# EasyEDA schematic SCH_St-Peters-Crest_2025-05-22.json
TITLE: LDR Colorimeter Mother Board 3; REV: 1.0; Date: 2023-10-12; Sheet: 1/1; Drawn By: d.c.gilmour; Company: Your Company
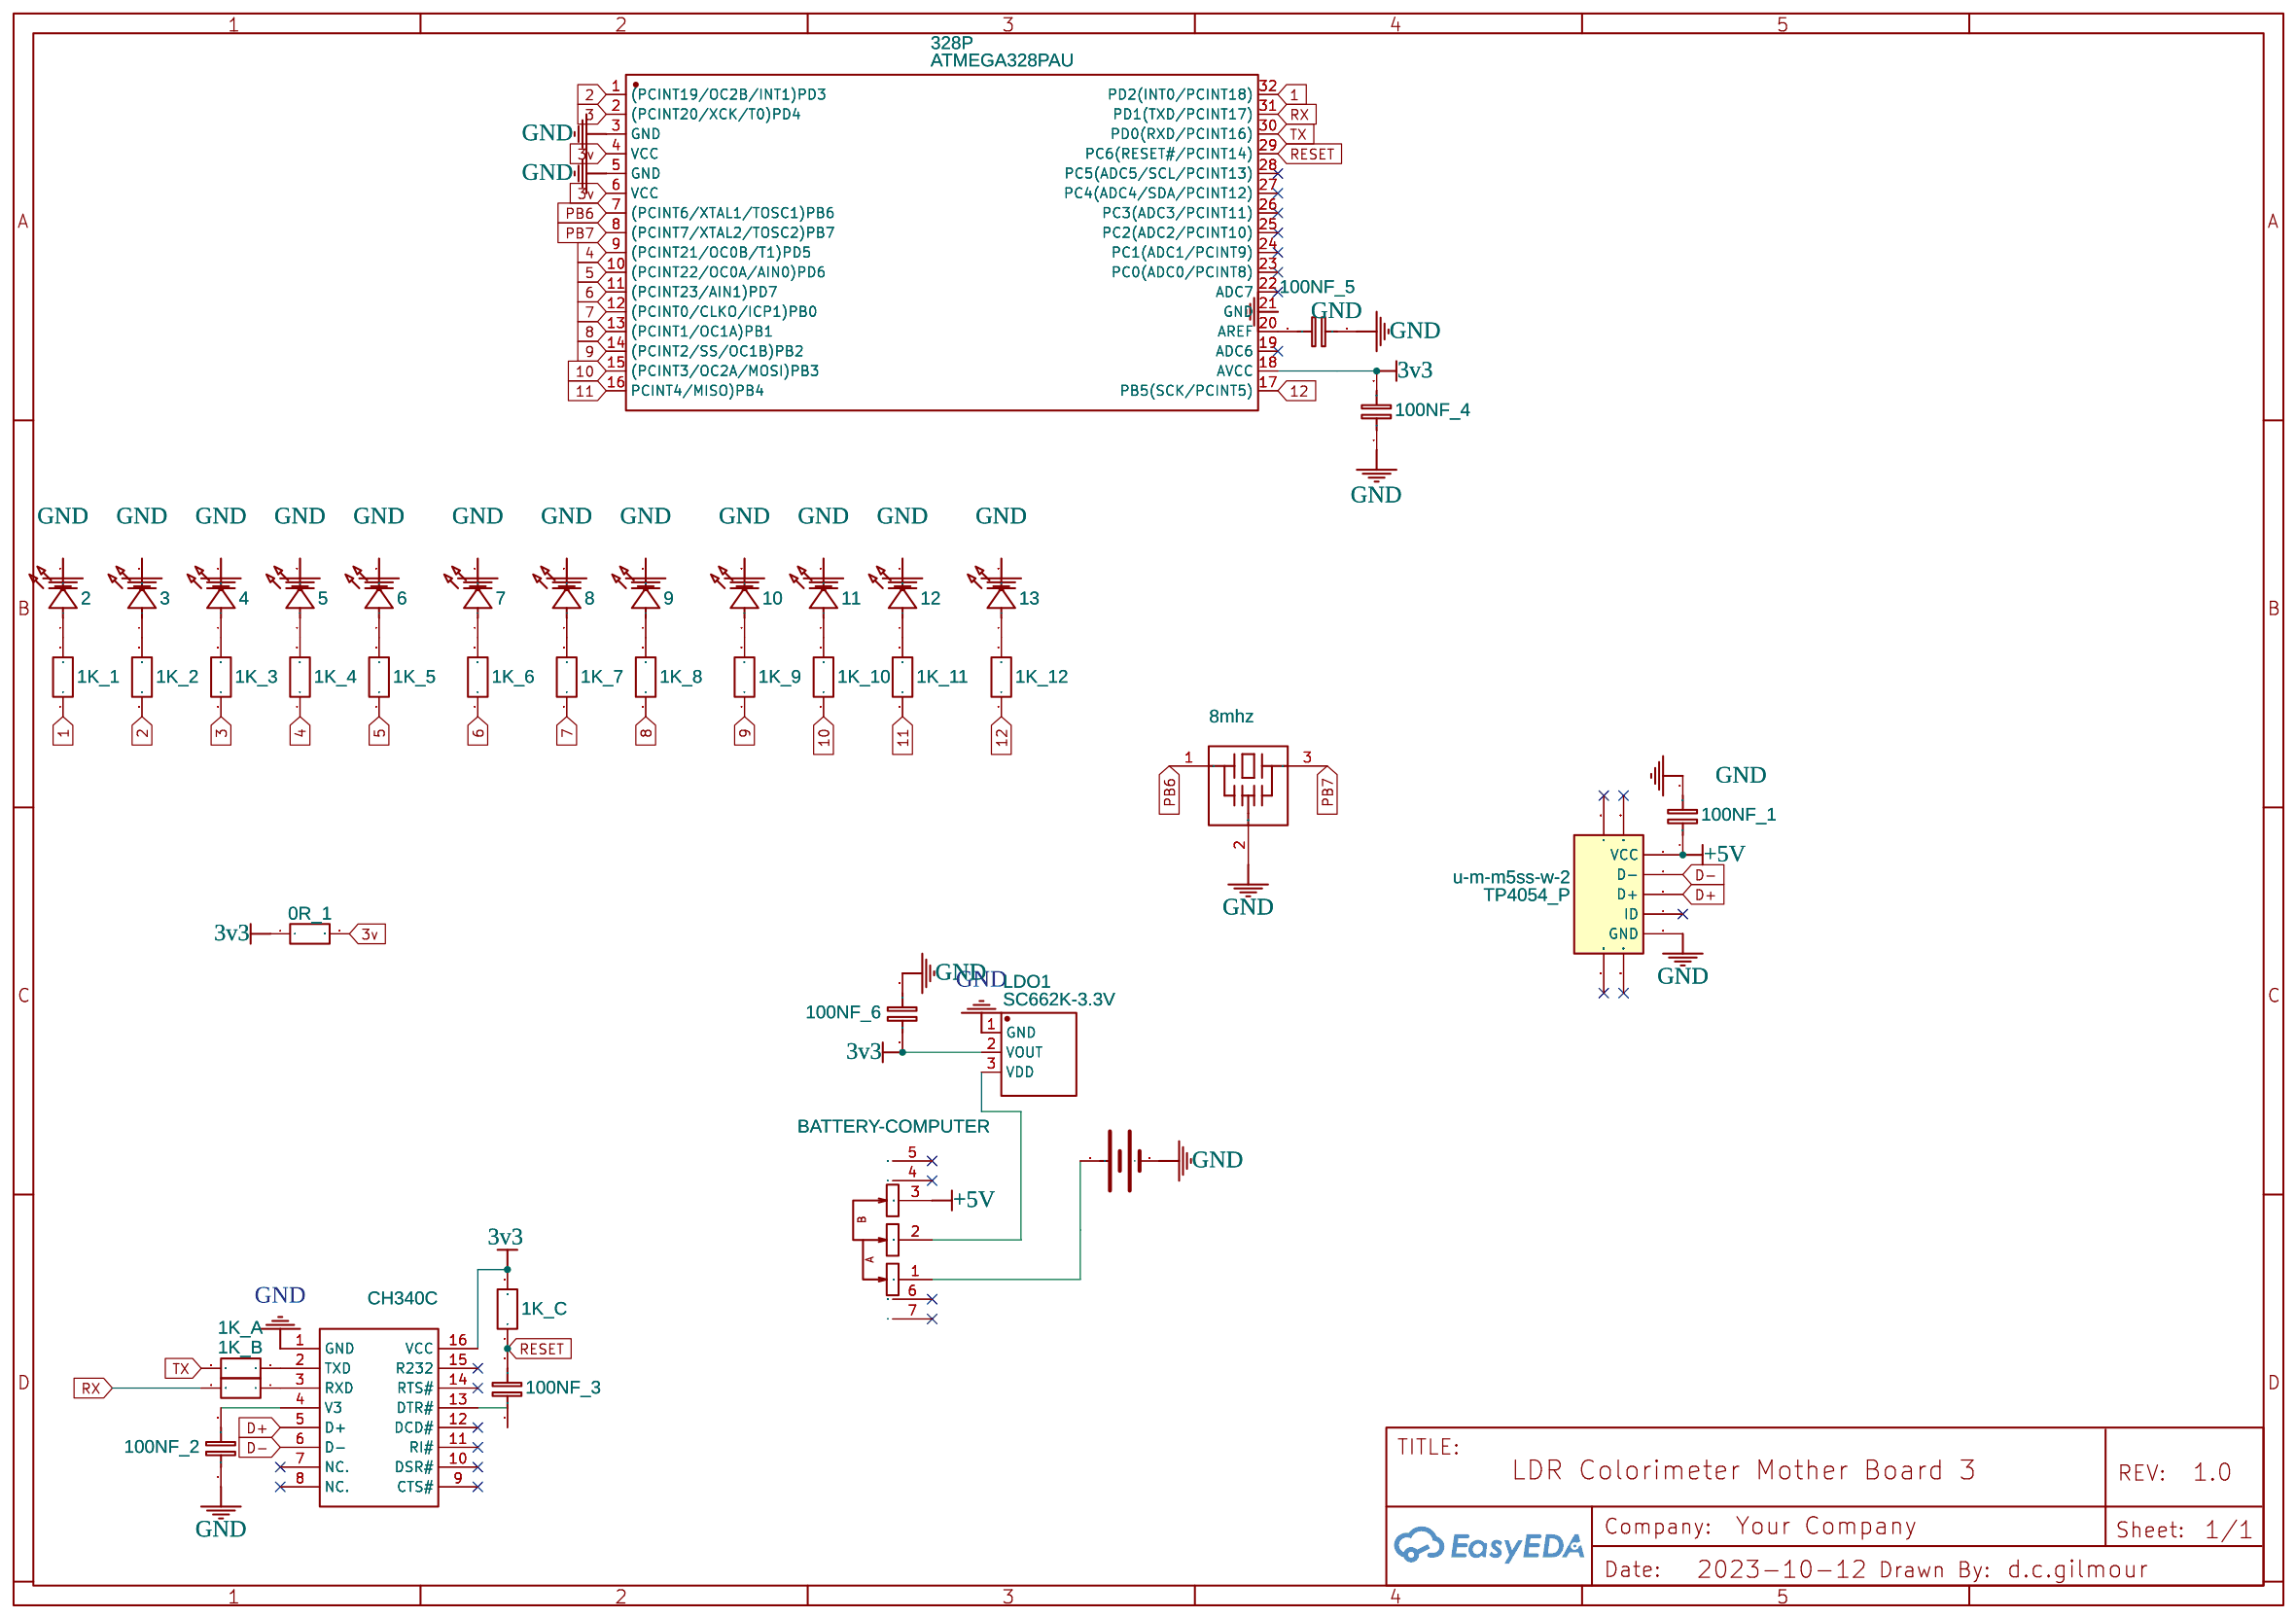
[diagram p0: schematic sheet]

## Parts
0R_1  1k  [R0603]
1K_1  1k  [R0603]
1K_2  1k  [R0603]
1K_3  1k  [R0603]
1K_4  1k  [R0603]
1K_5  1k  [R0603]
1K_6  1k  [R0603]
1K_7  1k  [R0603]
1K_8  1k  [R0603]
1K_9  1k  [R0603]
1K_10  1k  [R0603]
1K_11  1k  [R0603]
1K_12  1k  [R0603]
1K_A  1k  [R0603]
1K_B  1k  [R0603]
1K_C  1k  [R0603]
2  XL-3216SURC  [LED1206-R-RD_RED]
3  XL-3216SURC  [LED1206-R-RD_RED]
4  XL-3216SURC  [LED1206-R-RD_RED]
5  XL-3216SURC  [LED1206-R-RD_RED]
6  XL-3216SURC  [LED1206-R-RD_RED]
7  XL-3216SURC  [LED1206-R-RD_RED]
8  XL-3216SURC  [LED1206-R-RD_RED]
9  XL-3216SURC  [LED1206-R-RD_RED]
10  XL-3216SURC  [LED1206-R-RD_RED]
11  XL-3216SURC  [LED1206-R-RD_RED]
12  XL-3216SURC  [LED1206-R-RD_RED]
13  XL-3216SURC  [LED1206-R-RD_RED]
16MHZ  8mhz  [OSC-SMD_3P-L3.2-W1.3-P1.2-L]
100NF_1  0.1u  [C0603]
100NF_2  0.1u  [C0603]
100NF_3  0.1u  [C0603]
100NF_4  0.1u  [C0603]
100NF_5  0.1u  [C0603]
100NF_6  0.1u  [C0603]
328P  ATMEGA328PAU  [LQFP-32_L7.0-W7.0-P0.80-LS9.0-BL]
BATTERY-COMPUTER  MK-12C02-G015_C9900021215  [SW-SMD_G-SWITCH_MK-12C02-G015]
CH340C  CH340C  [SOP-16_L10.0-W3.9-P1.27-LS6.0-BL]
LDO1  SC662K-3.3V  [SOT-23(SOT-23-3)]
TP4054_P  u-m-m5ss-w-2  [MICRO-USB-SMD_MICRO-USB-13]
U1  CR2032-卧式贴片  [BAT-SMD_CR2032-C9900005595]

## Library data of the parts
0R_1 1K_1-1K_12 1K_A 1K_B 1K_C = R_0603_EU: Contributor: LCEDA_Lib
2-13 = XL-3216SURC: Supplier: LCSC; Supplier Part: C965822; Manufacturer: XINGLIGHT(成兴光); JLCPCB Part Class: Extended Part; Contributor: LCSC
16MHZ = CSTCE16M0V13C99-R0: Supplier: LCSC; Manufacturer: muRata(村田); Supplier Part: C118038; JLCPCB Part Class: Extended Part
100NF_1-100NF_6 = C_0603_EU: Contributor: LCEDA_Lib
328P = ATMEGA328PAU: Contributor: lcsc; Supplier: LCSC; Supplier Part: C9900004716; Manufacturer: null; Manufacturer Part: Atmega328pAU; JLCPCB Part Class: Extended Part; link: https://lcsc.com/eda_search?q=C9900004716&%26type=1&ref=editor
BATTERY-COMPUTER = MK-12C02-G015_C9900021215: Contributor: lcsc; Supplier: LCSC; Supplier Part: C9900021215; Manufacturer: null; Manufacturer Part: MK-12C02-G015; JLCPCB Part Class: Extended Part; link: https://lcsc.com/eda_search?q=C9900021215&%26type=1&ref=editor
CH340C = CH340C: Supplier: LCSC; Manufacturer: WCH(南京沁恒); Supplier Part: C84681; JLCPCB Part Class: Extended Part
LDO1 = SC662K-3.3V: Supplier Part: C83932; Supplier: LCSC; Manufacturer: FM
TP4054_P = u-m-m5ss-w-2: Supplier: LCSC; Manufacturer: 韩国韩荣; Manufacturer Part: U-M-M5SS-W-2; Supplier Part: C91144; JLCPCB Part Class: Extended Part
U1 = CR2032-卧式贴片: Contributor: LCSC; Supplier: LCSC; Supplier Part: C9900005595; Manufacturer: null; JLCPCB Part Class: Extended Part

## Nets
3v: 0R_1.2 328P.4(VCC) 328P.6(VCC)
3v3: 0R_1.1 1K_C.2 100NF_4.2 100NF_6.1 328P.18(AVCC) CH340C.16(VCC) LDO1.2(VOUT)
+5V: 100NF_1.1 BATTERY-COMPUTER.3 TP4054_P.1(VCC)
GND: 2.2(A) 3.2(A) 4.2(A) 5.2(A) 6.2(A) 7.2(A) 8.2(A) 9.2(A) 10.2(A) 11.2(A) 12.2(A) 13.2(A) 16MHZ.2(VSS) 100NF_1.2 100NF_2.1 100NF_4.1 100NF_5.1 100NF_6.2 328P.3(GND) 328P.5(GND) 328P.21(GND) CH340C.1(GND) LDO1.1(GND) TP4054_P.5(GND) U1.1(-)
1: 1K_1.1 328P.32(PD2(INT0/PCINT18))
2: 1K_2.1 328P.1((PCINT19/OC2B/INT1)PD3)
3: 1K_3.1 328P.2((PCINT20/XCK/T0)PD4)
4: 1K_4.1 328P.9((PCINT21/OC0B/T1)PD5)
5: 1K_5.1 328P.10((PCINT22/OC0A/AIN0)PD6)
6: 1K_6.1 328P.11((PCINT23/AIN1)PD7)
7: 1K_7.1 328P.12((PCINT0/CLKO/ICP1)PB0)
8: 1K_8.1 328P.13((PCINT1/OC1A)PB1)
9: 1K_9.1 328P.14((PCINT2/SS/OC1B)PB2)
10: 1K_10.1 328P.15((PCINT3/OC2A/MOSI)PB3)
11: 1K_11.1 328P.16(PCINT4/MISO)PB4)
12: 1K_12.1 328P.17(PB5(SCK/PCINT5))
D+: CH340C.5(D+) TP4054_P.3(D+)
D-: CH340C.6(D-) TP4054_P.2(D-)
PB6: 16MHZ.1 328P.7((PCINT6/XTAL1/TOSC1)PB6)
PB7: 16MHZ.3 328P.8((PCINT7/XTAL2/TOSC2)PB7)
RESET: 1K_C.1 100NF_3.2 328P.29(PC6(RESET#/PCINT14))
RX: 1K_B.2 328P.31(PD1(TXD/PCINT17))
TX: 1K_A.2 328P.30(PD0(RXD/PCINT16))
Net-(1K_1-2): 1K_1.2 2.1(K)
Net-(1K_2-2): 1K_2.2 3.1(K)
Net-(1K_3-2): 1K_3.2 4.1(K)
Net-(1K_4-2): 1K_4.2 5.1(K)
Net-(1K_5-2): 1K_5.2 6.1(K)
Net-(1K_6-2): 1K_6.2 7.1(K)
Net-(1K_7-2): 1K_7.2 8.1(K)
Net-(1K_8-2): 1K_8.2 9.1(K)
Net-(1K_9-2): 1K_9.2 10.1(K)
Net-(1K_10-2): 1K_10.2 11.1(K)
Net-(1K_11-2): 1K_11.2 12.1(K)
Net-(1K_12-2): 1K_12.2 13.1(K)
Net-(1K_A-1): 1K_A.1 CH340C.2(TXD)
Net-(1K_B-1): 1K_B.1 CH340C.3(RXD)
Net-(100NF_2-2): 100NF_2.2 CH340C.4(V3)
Net-(100NF_3-1): 100NF_3.1 CH340C.13(DTR#)
Net-(100NF_5-2): 100NF_5.2 328P.20(AREF)
Net-(BATTERY-COMPUTER-1): BATTERY-COMPUTER.1 U1.2(+)
Net-(BATTERY-COMPUTER-2): BATTERY-COMPUTER.2 LDO1.3(VDD)

Not connected (* = marked no-connect by the designer): 328P 19(ADC6)* 22(ADC7)* 23(PC0(ADC0/PCINT8))* 24(PC1(ADC1/PCINT9))* 25(PC2(ADC2/PCINT10))* 26(PC3(ADC3/PCINT11))* 27(PC4(ADC4/SDA/PCINT12))* 28(PC5(ADC5/SCL/PCINT13))*; BATTERY-COMPUTER 4* 5* 6* 7*; CH340C 7(NC.)* 8(NC.)* 9(CTS#)* 10(DSR#)* 11(RI#)* 12(DCD#)* 14(RTS#)* 15(R232)*; TP4054_P 0(SHLD)* 4(ID)*
